# Altium schematic sheet Outputs.SchDoc
size A4
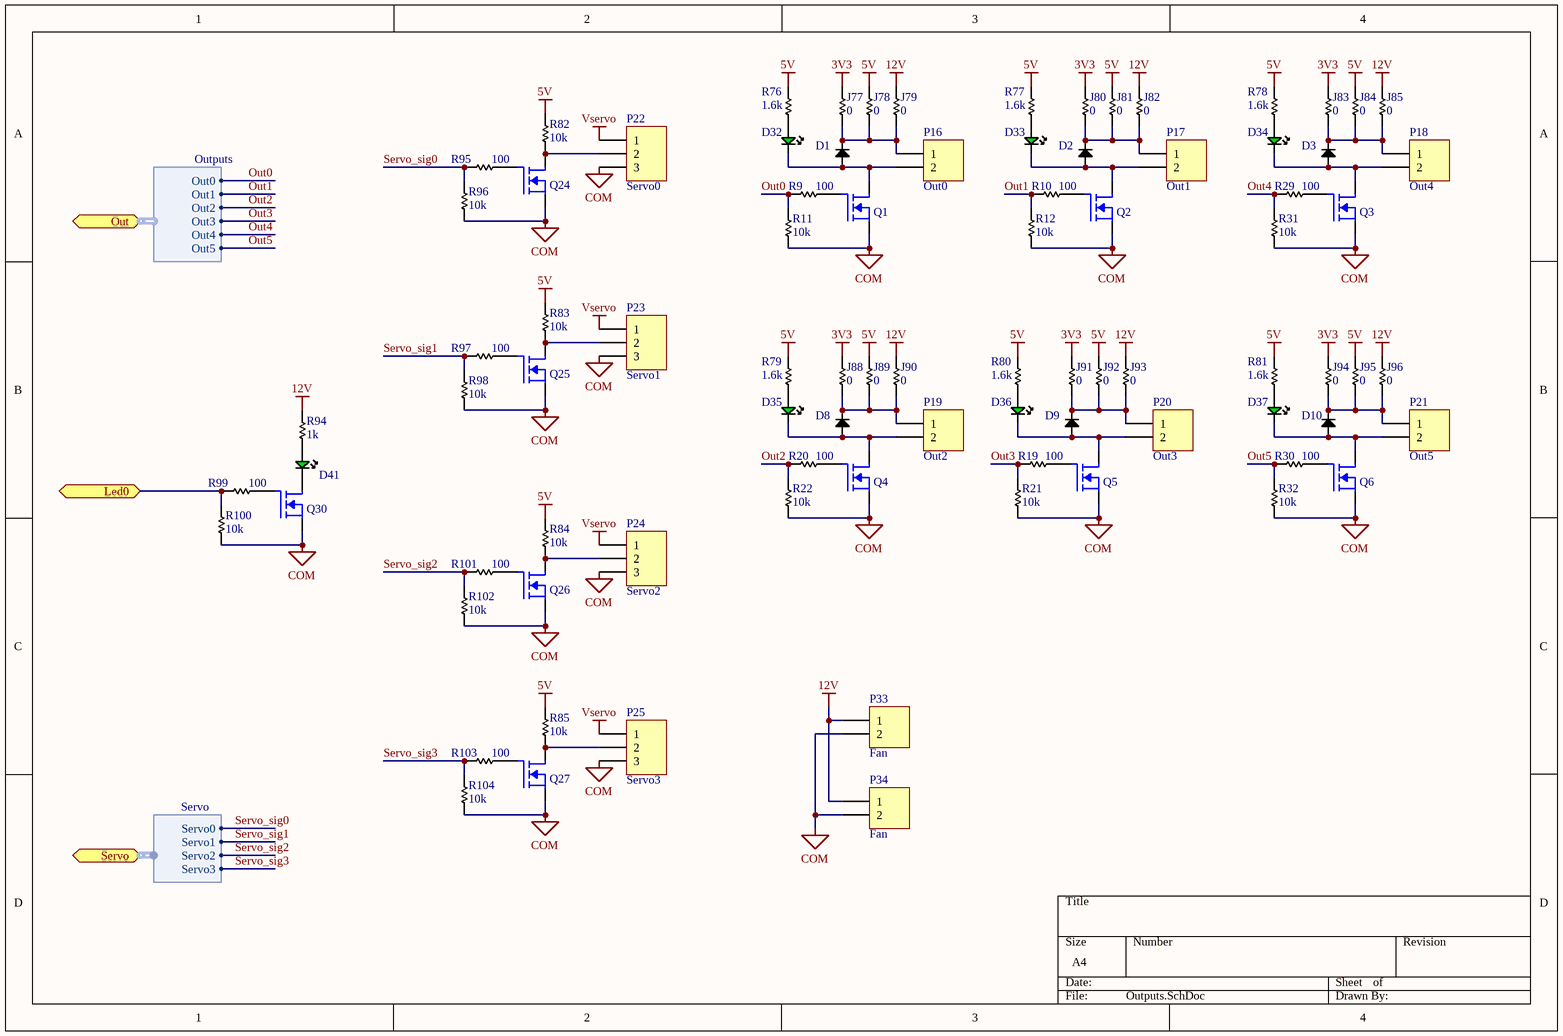
[diagram p0: Outputs.SchDoc]

## Parts
D1  Diode  [DOS-214AC (SMA)]  (value not drawn)
D2  Diode  [DOS-214AC (SMA)]  (value not drawn)
D3  Diode  [DOS-214AC (SMA)]  (value not drawn)
D8  Diode  [DOS-214AC (SMA)]  (value not drawn)
D9  Diode  [DOS-214AC (SMA)]  (value not drawn)
D10  Diode  [DOS-214AC (SMA)]  (value not drawn)
D32  Green  [0603 - Led Green]  (value not drawn)
D33  Green  [0603 - Led Green]  (value not drawn)
D34  Green  [0603 - Led Green]  (value not drawn)
D35  Green  [0603 - Led Green]  (value not drawn)
D36  Green  [0603 - Led Green]  (value not drawn)
D37  Green  [0603 - Led Green]  (value not drawn)
D41  Green  [0805 - Led Green]  (value not drawn)
J77  value 0  [0805 - Resistor]  (hidden comment: Res)
J78  value 0  [0805 - Resistor]  (hidden comment: Res)
J79  value 0  [0805 - Resistor]  (hidden comment: Res)
J80  value 0  [0805 - Resistor]  (hidden comment: Res)
J81  value 0  [0805 - Resistor]  (hidden comment: Res)
J82  value 0  [0805 - Resistor]  (hidden comment: Res)
J83  value 0  [0805 - Resistor]  (hidden comment: Res)
J84  value 0  [0805 - Resistor]  (hidden comment: Res)
J85  value 0  [0805 - Resistor]  (hidden comment: Res)
J88  value 0  [0805 - Resistor]  (hidden comment: Res)
J89  value 0  [0805 - Resistor]  (hidden comment: Res)
J90  value 0  [0805 - Resistor]  (hidden comment: Res)
J91  value 0  [0805 - Resistor]  (hidden comment: Res)
J92  value 0  [0805 - Resistor]  (hidden comment: Res)
J93  value 0  [0805 - Resistor]  (hidden comment: Res)
J94  value 0  [0805 - Resistor]  (hidden comment: Res)
J95  value 0  [0805 - Resistor]  (hidden comment: Res)
J96  value 0  [0805 - Resistor]  (hidden comment: Res)
P16  Out0  [Headers - 1x2 - Vertical - Lock]
P17  Out1  [Headers - 1x2 - Vertical - Lock]
P18  Out4  [Headers - 1x2 - Vertical - Lock]
P19  Out2  [Headers - 1x2 - Vertical - Lock]
P20  Out3  [Headers - 1x2 - Vertical - Lock]
P21  Out5  [Headers - 1x2 - Vertical - Lock]
P22  Servo0  [Headers - 1x3 - Vertical - Lock]
P23  Servo1  [Headers - 1x3 - Vertical - Lock]
P24  Servo2  [Headers - 1x3 - Vertical - Lock]
P25  Servo3  [Headers - 1x3 - Vertical - Lock]
P33  Fan  [Headers - 1x2 - Vertical - Lock]
P34  Fan  [Headers - 1x2 - Vertical - Lock]
Q1  MOSFET_N  [SOT23-3]  (value not drawn)
Q2  MOSFET_N  [SOT23-3]  (value not drawn)
Q3  MOSFET_N  [SOT23-3]  (value not drawn)
Q4  MOSFET_N  [SOT23-3]  (value not drawn)
Q5  MOSFET_N  [SOT23-3]  (value not drawn)
Q6  MOSFET_N  [SOT23-3]  (value not drawn)
Q24  MOSFET_N  [SOT23-3]  (value not drawn)
Q25  MOSFET_N  [SOT23-3]  (value not drawn)
Q26  MOSFET_N  [SOT23-3]  (value not drawn)
Q27  MOSFET_N  [SOT23-3]  (value not drawn)
Q30  MOSFET_N  [SOT23-3]  (value not drawn)
R9  value 100  [0805 - Resistor]  (hidden comment: Res)
R10  value 100  [0805 - Resistor]  (hidden comment: Res)
R11  value 10k  [0805 - Resistor]  (hidden comment: Res)
R12  value 10k  [0805 - Resistor]  (hidden comment: Res)
R19  value 100  [0805 - Resistor]  (hidden comment: Res)
R20  value 100  [0805 - Resistor]  (hidden comment: Res)
R21  value 10k  [0805 - Resistor]  (hidden comment: Res)
R22  value 10k  [0805 - Resistor]  (hidden comment: Res)
R29  value 100  [0805 - Resistor]  (hidden comment: Res)
R30  value 100  [0805 - Resistor]  (hidden comment: Res)
R31  value 10k  [0805 - Resistor]  (hidden comment: Res)
R32  value 10k  [0805 - Resistor]  (hidden comment: Res)
R76  value 1.6k  [0805 - Resistor]  (hidden comment: Res)
R77  value 1.6k  [0805 - Resistor]  (hidden comment: Res)
R78  value 1.6k  [0805 - Resistor]  (hidden comment: Res)
R79  value 1.6k  [0805 - Resistor]  (hidden comment: Res)
R80  value 1.6k  [0805 - Resistor]  (hidden comment: Res)
R81  value 1.6k  [0805 - Resistor]  (hidden comment: Res)
R82  value 10k  [0805 - Resistor]  (hidden comment: Res)
R83  value 10k  [0805 - Resistor]  (hidden comment: Res)
R84  value 10k  [0805 - Resistor]  (hidden comment: Res)
R85  value 10k  [0805 - Resistor]  (hidden comment: Res)
R94  value 1k  [0805 - Resistor]  (hidden comment: Res)
R95  value 100  [0805 - Resistor]  (hidden comment: Res)
R96  value 10k  [0805 - Resistor]  (hidden comment: Res)
R97  value 100  [0805 - Resistor]  (hidden comment: Res)
R98  value 10k  [0805 - Resistor]  (hidden comment: Res)
R99  value 100  [0805 - Resistor]  (hidden comment: Res)
R100  value 10k  [0805 - Resistor]  (hidden comment: Res)
R101  value 100  [0805 - Resistor]  (hidden comment: Res)
R102  value 10k  [0805 - Resistor]  (hidden comment: Res)
R103  value 100  [0805 - Resistor]  (hidden comment: Res)
R104  value 10k  [0805 - Resistor]  (hidden comment: Res)

## Ports
Led0, Out (harness Outputs), Servo (harness Servo)

## Harnesses
Outputs: Out0, Out1, Out2, Out3, Out4, Out5
Servo: Servo0, Servo1, Servo2, Servo3

## Nets
3V3: J77.2 J80.2 J83.2 J88.2 J91.2 J94.2
5V: J78.2 J81.2 J84.2 J89.2 J92.2 J95.2 R76.2 R77.2 R78.2 R79.2 R80.2 R81.2 R82.2 R83.2 R84.2 R85.2
12V: J79.2 J82.2 J85.2 J90.2 J93.2 J96.2 P33.1 P34.1 R94.1
COM: P22.3 P23.3 P24.3 P25.3 P33.2 P34.2 Q1.2(S) Q2.2(S) Q3.2(S) Q4.2(S) Q5.2(S) Q6.2(S) Q24.2(S) Q25.2(S) Q26.2(S) Q27.2(S) Q30.2(S) R11.1 R12.1 R21.1 R22.1 R31.1 R32.1 R96.1 R98.1 R100.1 R102.1 R104.1
Vservo: P22.1 P23.1 P24.1 P25.1
Led0: R99.1 R100.2 ; port Led0
Out0: R9.1 R11.2 ; port Out.Out0
Out1: R10.1 R12.2 ; port Out.Out1
Out2: R20.1 R22.2 ; port Out.Out2
Out3: R19.1 R21.2 ; port Out.Out3
Out4: R29.1 R31.2 ; port Out.Out4
Out5: R30.1 R32.2 ; port Out.Out5
Servo_sig0: R95.1 R96.2 ; port Servo.Servo0
Servo_sig1: R97.1 R98.2 ; port Servo.Servo1
Servo_sig2: R101.1 R102.2 ; port Servo.Servo2
Servo_sig3: R103.1 R104.2 ; port Servo.Servo3
NetD1_1: D1.1(A) D32.2(K) P16.2 Q1.3(D)
NetD1_2: D1.2(K) J77.1 J78.1 J79.1 P16.1
NetD2_1: D2.1(A) D33.2(K) P17.2 Q2.3(D)
NetD2_2: D2.2(K) J80.1 J81.1 J82.1 P17.1
NetD3_1: D3.1(A) D34.2(K) P18.2 Q3.3(D)
NetD3_2: D3.2(K) J83.1 J84.1 J85.1 P18.1
NetD8_1: D8.1(A) D35.2(K) P19.2 Q4.3(D)
NetD8_2: D8.2(K) J88.1 J89.1 J90.1 P19.1
NetD9_1: D9.1(A) D36.2(K) P20.2 Q5.3(D)
NetD9_2: D9.2(K) J91.1 J92.1 J93.1 P20.1
NetD10_1: D10.1(A) D37.2(K) P21.2 Q6.3(D)
NetD10_2: D10.2(K) J94.1 J95.1 J96.1 P21.1
NetD32_1: D32.1(A) R76.1
NetD33_1: D33.1(A) R77.1
NetD34_1: D34.1(A) R78.1
NetD35_1: D35.1(A) R79.1
NetD36_1: D36.1(A) R80.1
NetD37_1: D37.1(A) R81.1
NetD41_1: D41.1(A) R94.2
NetD41_2: D41.2(K) Q30.3(D)
NetP22_2: P22.2 Q24.3(D) R82.1
NetP23_2: P23.2 Q25.3(D) R83.1
NetP24_2: P24.2 Q26.3(D) R84.1
NetP25_2: P25.2 Q27.3(D) R85.1
NetQ1_1: Q1.1(G) R9.2
NetQ2_1: Q2.1(G) R10.2
NetQ3_1: Q3.1(G) R29.2
NetQ4_1: Q4.1(G) R20.2
NetQ5_1: Q5.1(G) R19.2
NetQ6_1: Q6.1(G) R30.2
NetQ24_1: Q24.1(G) R95.2
NetQ25_1: Q25.1(G) R97.2
NetQ26_1: Q26.1(G) R101.2
NetQ27_1: Q27.1(G) R103.2
NetQ30_1: Q30.1(G) R99.2

## Library data of the parts
D1-D3 D8-D10 = S1M-13-F: DIODE GEN PURPOSE 1000V 1A SMA; Manufacturer: Diodes Inc.; Manufacturer No: BAS21LT3G; Sub Category: Single; Voltage: 1.1V @ 1A; Part Number: S1M-13-F; Category: Diode; Pin count: 2; Package: SMA; Supplier 1: Digi-Key; Supplier Part Number 1: S1M-FDICT-ND; ComponentLink1URL: http://www.diodes.com/datasheets/ds16003.pdf; ComponentLink1Description: Datasheet; Creation Date: 2013-10-21 20:14:01; Created by: Pier-Yves; Value: SMA; Current: 1A; Temperature: -55°C ~ 150°C
D32-D37 = LED-Green-2mA-lowBrigthness-0603: LED SMARTLED GREEN 570NM 0603; Manufacturer: OSRAM Opto Semiconductor; Manufacturer No: LG L29K-G2J1-24-Z; Sub Category: 0603; Value: 3.92 mcd; Voltage: 1.7V; Current: 2mA; Part Number: LED-Green-2mA-lowBrigthness-0603; Category: LED; Pin count: 2; Package: 0603; Series: SmartLED; Supplier 1: Digi-Key; Supplier Part Number 1: 475-2709-1-ND; ComponentLink1URL: http://catalog.osram-os.com/catalogue/catalogue.do;jsessionid=32CB61882C089EDD4B6D0A54E7E1F117?act=downloadFile&favOid=020000020000138e000100b6; ComponentLink1Description: Datasheet; Creation Date: 2013-11-17 11:13:55; Created by: Pier-Yves; Height: 0.65mm
D41 = LED-Green-lowBrigthness-0805: Led Green 0805 Low Brightness - 10mA; Manufacturer: Lite-On inc.; Manufacturer No: LTST-C170GKT; Sub Category: 0805; Value: 6mcd; Voltage: 2.1V; Part Number: LED-Green-lowBrigthness-0805; Category: LED; Pin count: 2; Package: 0805; Supplier 1: Digi-Key; Supplier Part Number 1: 160-1179-1-ND; ComponentLink1URL: http://media.digikey.com/pdf/Data%20Sheets/Lite-On%20PDFs/LTST-C170GKT.pdf; ComponentLink1Description: Datasheet; Created by: Pier-Yves; Height: 1.10mm; Current: 10mA
J77-J85 J88-J96 = Jumper-0805: RES 0.0 OHM 1/8W JUMP 0805; Manufacturer: Stackpole electronic; Manufacturer No: RMCF0805ZT0R00; Sub Category: 0805; Current: 2A; Part Number: Jumper-0805; Category: Resistor; Pin count: 2; Package: 0805; Series: RMFC; Supplier 1: Digi-Key; Supplier Part Number 1: RMCF0805ZT0R00CT-ND; ComponentLink1URL: http://www.seielect.com/Catalog/SEI-RMCF_RMCP.pdf; ComponentLink1Description: Datasheet; Creation Date: 2013-09-21 02:33:24; Created by: Pier-Yves; Power: 1/8W; Height: 0.65mm
P16-P21 P33 P34 = Header-0.100-Vertical-Lock-1X2: CONN HEADER 2POS .100" STR TIN; Manufacturer: Molex Inc; Manufacturer No: 0901361102; Sub Category: 100mils Vertical lock; Value: 2 pins; LatestRevisionDate: 17-Jul-2002; LatestRevisionNote: Re-released for DXP Platform.; Publisher: Altium Limited; Part Number: Header-0.100-Vertical-Lock-1X2; Category: Header; Pin count: 2; Series: C-Grid III 90136; Supplier 1: Digi-Key; Supplier Part Number 1: WM8213-ND; ComponentLink1URL: http://www.molex.com/pdm_docs/sd/901361102_sd.pdf; ComponentLink1Description: Datasheet; Creation Date: 2013-11-05 17:17:54; Created by: Pier-Yves; Height: 10.9mm
P22-P25 = Header-0.100-Vertical-Lock-1X3: CONN HEADER 3POS .100" STR TIN; Manufacturer: Molex Inc; Manufacturer No: 0901361103; Sub Category: 100mils Vertical lock; Value: 3 pins; LatestRevisionDate: 17-Jul-2002; LatestRevisionNote: Re-released for DXP Platform.; Publisher: Altium Limited; Part Number: Header-0.100-Vertical-Lock-1X3; Category: Header; Pin count: 3; Series: C-Grid III 90136; Supplier 1: Digi-Key; Supplier Part Number 1: WM8214-ND; ComponentLink1URL: http://www.molex.com/pdm_docs/sd/901361103_sd.pdf; ComponentLink1Description: Datasheet; Creation Date: 2013-11-05 17:17:54; Created by: Pier-Yves; Height: 10.9mm
Q1-Q6 Q24-Q27 Q30 = 2N7002: MosFET Channel-N SOT-23-3 3.3A; Part Number: 2N7002; Manufacturer: Vishay Siliconix; Manufacturer No: SI2304DDS-T1-GE3; Sub Category: MOSFET-N; Value: Channel N; Power: 1.7W; Voltage: 30V; Category: Transistor; Pin count: 3; Package: SOT-23-3; Series: ÉTrenchFET; Supplier 1: Digi-Key; Supplier Part Number 1: SI2304DDS-T1-GE3CT-ND; ComponentLink1URL: http://www.vishay.com/docs/65175/si2304dd.pdf; ComponentLink1Description: Datasheet; Creation Date: 2013-06-28 13:51:31; Created by: Pier-Yves; Current: 3.3A
R9 R10 R19 R20 R29 R30 R95 R97 R99 R101 R103 = Yagao-RC0805-100: RES 100 OHM 1/8W 5% 0805 SMD; Manufacturer: Yagao; Manufacturer No: RC0805JR-07100RL; Sub Category: 0805; Part Number: Yagao-RC0805-100; Category: Resistor; Pin count: 2; Package: 0805; Series: RC0805; Supplier 1: Digi-Key; Supplier Part Number 1: 311-100ARCT-ND; ComponentLink1URL: http://media.digikey.com/pdf/Data%20Sheets/Yageo%20PDFs/RC0805%20Pb%20Free.pdf; ComponentLink1Description: Datasheet; Creation Date: 2013-06-28 03:21:03; Created by: Pier-Yves; Tolerance: 5%; Power: 1/8W; Height: 0.6mm
R11 R12 R21 R22 R31 R32 R82-R85 R96 R98 R100 R102 R104 = Yagao-RC0805-10k: RES 10K OHM 1/8W 5% 0805 SMD; Manufacturer: Yagao; Manufacturer No: RC0805JR-0710KL; Sub Category: 0805; Part Number: Yagao-RC0805-10k; Category: Resistor; Pin count: 2; Package: 0805; Series: RC0805; Supplier 1: Digi-Key; Supplier Part Number 1: 311-10KARCT-ND; ComponentLink1URL: http://media.digikey.com/pdf/Data%20Sheets/Yageo%20PDFs/RC0805%20Pb%20Free.pdf; ComponentLink1Description: Datasheet; Creation Date: 2013-06-28 03:21:03; Created by: Pier-Yves; Tolerance: 5%; Power: 1/8W; Height: 0.6mm
R76-R81 = Yagao-RC0805-1.6k: RES 1.6K OHM 1/8W 5% 0805 SMD; Manufacturer: Yagao; Manufacturer No: RC0805JR-071K6L; Sub Category: 0805; Part Number: Yagao-RC0805-1.6k; Category: Resistor; Pin count: 2; Package: 0805; Series: RC0805; Supplier 1: Digi-Key; Supplier Part Number 1: 311-1.6KARCT-ND; ComponentLink1URL: http://media.digikey.com/pdf/Data%20Sheets/Yageo%20PDFs/RC0805%20Pb%20Free.pdf; ComponentLink1Description: Datasheet; Creation Date: 2013-06-28 03:21:03; Created by: Pier-Yves; Tolerance: 5%; Power: 1/8W; Height: 0.6mm
R94 = Yagao-RC0805-1k: RES 1.0K OHM 1/8W 5% 0805 SMD; Manufacturer: Yagao; Manufacturer No: RC0805JR-071KL; Sub Category: 0805; Part Number: Yagao-RC0805-1k; Category: Resistor; Pin count: 2; Package: 0805; Series: RC0805; Supplier 1: Digi-Key; Supplier Part Number 1: 311-1.0KARCT-ND; ComponentLink1URL: http://media.digikey.com/pdf/Data%20Sheets/Yageo%20PDFs/RC0805%20Pb%20Free.pdf; ComponentLink1Description: Datasheet; Creation Date: 2013-06-28 03:21:03; Created by: Pier-Yves; Tolerance: 5%; Power: 1/8W; Height: 0.6mm